# EAGLE schematic Bench SMPS (EAGLE 6.2)
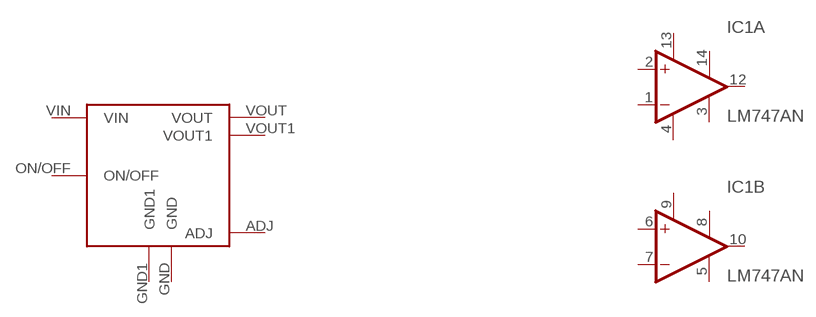
[diagram p0: schematic, sheet 1]

## Parts
IC1  LM747AN  [DIL14]
U$1  KIS-3R33S  [KIS-3R33S]
Unconnected: IC1.1(A:-IN) IC1.2(A:+IN) IC1.3(A:NULL1) IC1.5(B:NULL1) IC1.6(B:+IN) IC1.7(B:-IN) IC1.8(B:NULL2) IC1.10(B:OUT) IC1.12(A:OUT) IC1.14(A:NULL2) U$1.ADJ U$1.GND U$1.GND1 U$1.ON/OFF U$1.VIN U$1.VOUT U$1.VOUT1

## Power pins joined to a net without a drawn wire
V+: IC1.9(B:V+) IC1.13(A:V+)
V-: IC1.4(P:V-)

## Library data of the parts
IC1 = linear:LM747*: Dual Operational Amplifier Source: http://cache.national.com/ds/LM/LM747.pdf
U$1 = RobThePyro:KIS-3R33S